# Altium schematic sheet USBtoTTL.SchDoc
size 177 x 127 mm
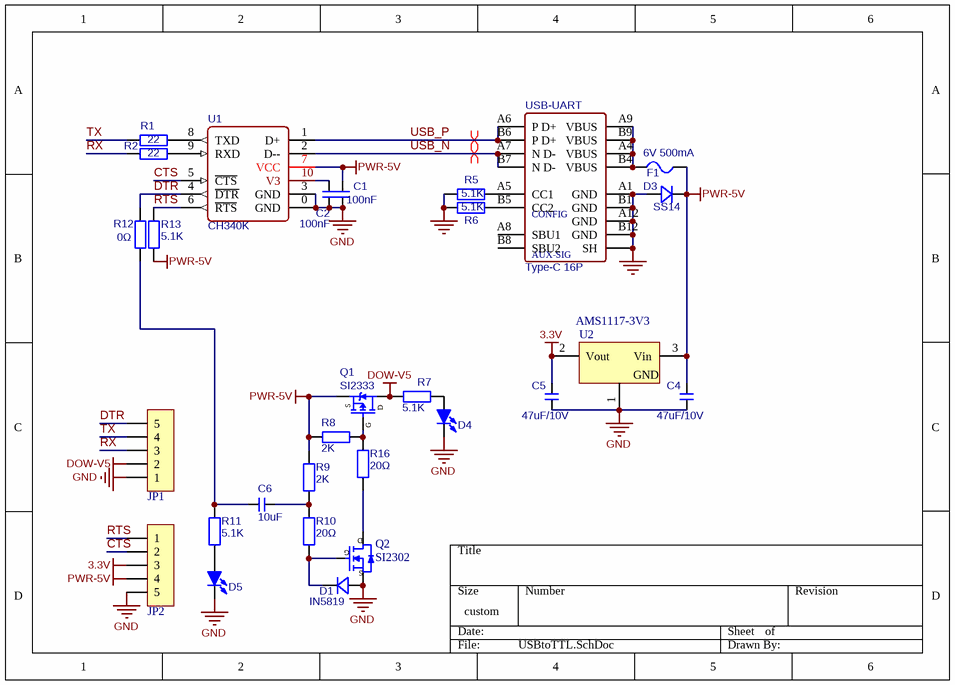
[diagram p0: USBtoTTL.SchDoc]

## Parts
C1  100nF  [C 0402_L]
C2  100nF  [C 0402_L]
C4  47uF/10V  [C 0805_L]
C5  47uF/10V  [C 0805_L]
C6  10uF  [C 0805_L]
D1  IN5819  [SOD-523]
D3  SS14  [SOD-323]
D4  BLUE  [LED 0603_M]  (value not drawn)
D5  BLUE  [LED 0603_M]  (value not drawn)
F1  value 6V 500mA  [FU 0603]  (hidden comment: BSMD0603-050-6V)
JP1  HDR-1X5  [HDR2.54-WS-5P]  (value not drawn)
JP2  HDR-1X5  [HDR2.54-WS-5P]  (value not drawn)
Q1  SI2333  [SOT23-3L]
Q2  SI2302  [SOT23-3L]
R1  22  [R 0402_L]
R2  22  [R 0402_L]
R5  5.1K  [R 0402_L]
R6  5.1K  [R 0402_L]
R7  5.1K  [R 0402_L]
R8  2K  [R 0402_L]
R9  2K  [R 0402_L]
R10  20Ω  [R 0402_L]
R11  5.1K  [R 0402_L]
R12  0Ω  [R 0402_L]
R13  5.1K  [R 0402_L]
R16  20Ω  [R 0402_L]
U1  CH340K  [ESSOP-10_L]
U2  AMS1117-3V3  [SOT89_L]
USB-UART  Type-C 16P  [USB-C/S_16P_M]

## Nets
3.3V: C5.2(K) JP2.3 U2.2(Vout)
DOW-V5: JP1.2 Q1.3(D) R7.2
GND: C1.1(A) C2.1(A) C4.1(A) C5.1(A) D1.1 D3.1 D4.2(K) D5.2(K) JP1.1 JP2.5 Q2.2(S) R5.1 R6.1 U1.0(GND) U1.3(GND) U2.1(GND) USB-UART.1(SH) USB-UART.A1(GND) USB-UART.A12(GND) USB-UART.B1(GND) USB-UART.B12(GND)
PWR-5V: C1.2(K) C4.2(K) D3.2 F1.2 JP2.4 Q1.2(S) R8.1 R9.1 R13.2 U1.7(VCC) U2.3(Vin)
CTS: JP2.2 U1.5(~{CTS})
DTR: JP1.5 R12.1 U1.4(~{DTR})
RTS: JP2.1 R13.1 U1.6(~{RTS})
RX: JP1.3 R2.1
TX: JP1.4 R1.1
USB_N: U1.2(D--) USB-UART.A7(N_D-) USB-UART.B7(N_D-)
USB_P: U1.1(D+) USB-UART.A6(P_D+) USB-UART.B6(P_D+)
NetC2_2: C2.2(K) U1.10(V3)
NetC6_1: C6.1(A) R9.2 R10.1
NetC6_2: C6.2(K) R11.1 R12.2
NetD1_2: D1.2 Q2.1(G) R10.2
NetD4_1: D4.1(A) R7.1
NetD5_1: D5.1(A) R11.2
NetF1_1: F1.1 USB-UART.A4(VBUS) USB-UART.A9(VBUS) USB-UART.B4(VBUS) USB-UART.B9(VBUS)
NetQ1_1: Q1.1(G) R8.2 R16.1
NetQ2_3: Q2.3(D) R16.2
NetR1_2: R1.2 U1.8(TXD)
NetR2_2: R2.2 U1.9(RXD)
NetR5_2: R5.2 USB-UART.A5(CC1)
NetR6_2: R6.2 USB-UART.B5(CC2)

Not connected (* = marked no-connect by the designer): USB-UART A8(SBU1) B8(SBU2)

## Layout directives
differential pair: USB_N, USB_P

## Notes on the sheet
- (in symbol USB-C/S 16P) CONFIG; AUX-SIG

## Library data of the parts
C1 C2 C4-C6 = C-MLCC: 无极性贴片多层陶瓷电容器; BOM名称: 无极性贴片电容; 版权归属: 源创客; 材质: X7R; 学习资源: www.ooocke.com
D1 D3 = 1N4948: 快恢复开关二极管-所有封装; BOM名称: 整流二极管; 版权归属: 源创客; 学习资源: www.ooocke.com
D4 D5 = LED-SMD: 贴片LED; 版权归属: 封装库来自淘宝 ID：黄晶宝石; BOM名称: 贴片LED; 学习资源: https://shop463601444.taobao.com; 嘉立创编号: C84266
F1 = FU: 贴片保险丝; 版权归属: 封装库来自淘宝卖家 ID：黄晶宝石; BOM名称: 贴片保险丝; 学习资源: https://shop463601444.taobao.com
JP1 JP2 = Header 5: 5P接插件; 版权归属: 封装库来自淘宝 ID：黄晶宝石; BOM名称: 5P接插件; 学习资源: https://shop463601444.taobao.com
Q1 = CJ2333: P沟道 12V/6A; BOM名称: 场效应管; 版权归属: 源创客; 描述: P沟道 20V/2.8A; 学习资源: www.ooocke.com
Q2 = SI2302: N沟道 20V/3A; BOM名称: 场效应管; 版权归属: 源创客; 学习资源: www.ooocke.com; 描述: N沟道 20V/3A
R1 R2 R5-R13 R16 = RES: 贴片电阻; 版权归属: 来自淘宝 ID：黄晶宝石; 封装库来自淘宝卖家 ID：黄晶宝石: 其他店铺购入均为盗版，不享受售后技术支持服务，请立即申请退款; BOM名称: 贴片电阻; 联系售后: https://shop463601444.taobao.com
U1 = CH340K: USB转串口; BOM_Manufacturer: WCH; BOM_Manufacturer Part: CH340C; BOM_Paste Type: recommend; BOM_Supplier: LCSC; BOM_Supplier Part: C84681; spicePre: U; spiceSymbolName: CH340C
U2 = AMS1117: 三端稳压; BOM名称: 稳压芯片; 淘宝ID: 封装库来自淘宝 ID：黄晶宝石; 欢迎光临淘宝店铺: https://shop463601444.taobao.com
USB-UART = USB-C/S 16P: TYPE-C 16Pin母座; BOM名称: USB-C型母接口; 学习资源: 封装库来自淘宝卖家 ID：黄晶宝石; 封装库来自淘宝 ID：黄晶宝石: https://shop463601444.taobao.com